# EAGLE design OPEN DROP DIGISCOPE (EAGLE 7.2.0)
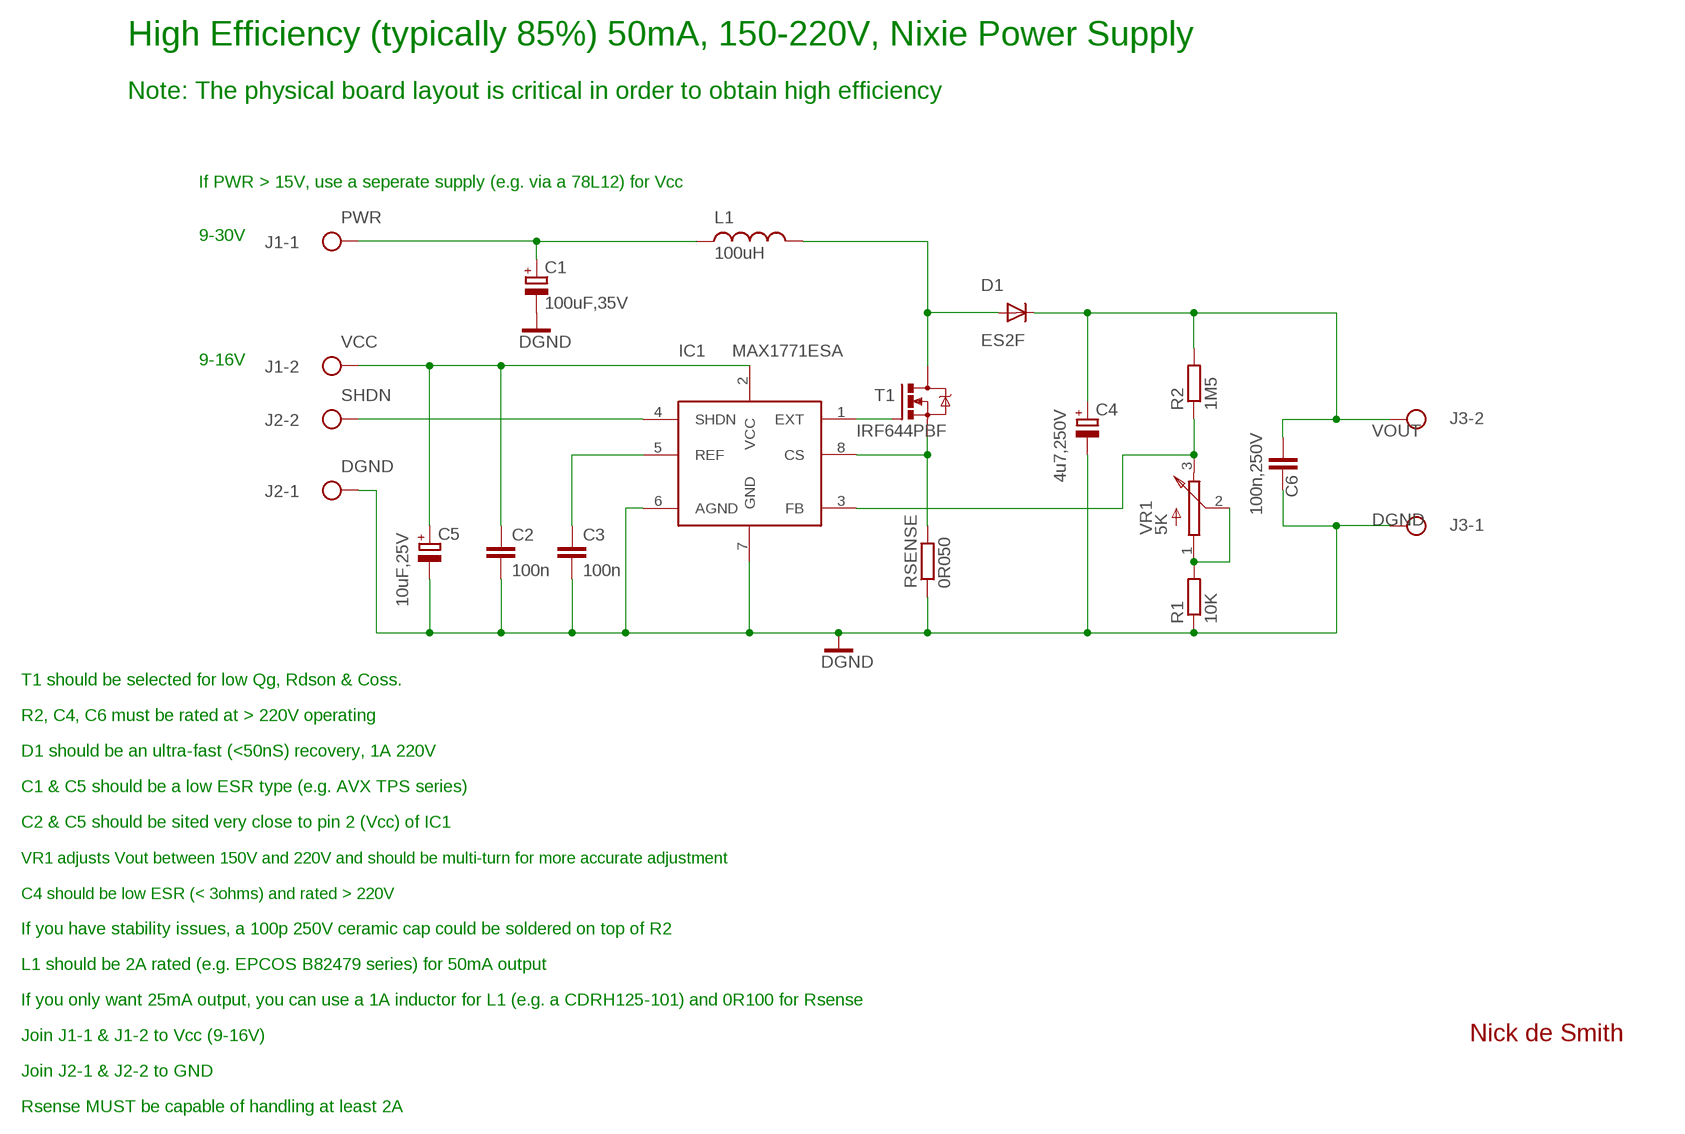
[diagram p0: schematic, sheet 1]

## Parts
C1  100uF,35V  C-POL-EU7343  [C-EIA-7343]
C2  100n  C-EUC0805  [C0805]
C3  100n  C-EUC0805  [C0805]
C4  4u7,250V  C-POL-EU-NICHICON-UJ-12  [NICHICON-UJ-12]
C5  10uF,25V  C-POL-EU7343  [C-EIA-7343]
C6  100n,250V  C-EU-2420  [C2420]
D1  ES2F  DIODE-SMC  [SMC]
IC1  MAX1771ESA  [SO-8]
J1  TERM-BLOCK-2-02IN  [SCREW-2-02]
J2  TERM-BLOCK-2-02IN  [SCREW-2-02]
J3  TERM-BLOCK-2-02IN  [SCREW-2-02]
L1  100uH  L-SMT-POWER-B82479  [L-B82479]
R1  10K  R-EU_R0805  [R0805]
R2  1M5  R-EU_R2512  [R2512]
RSENSE  0R050  R-EU_R2010  [R2010]
T1  IRF644PBF  IRF740  [TO220BV]
VR1  5K  TRIMPOT-3214W  [BOURNS-3214W]

## Nets
DGND [power]: C1.- C2.2 C3.2 C4.1(-) C5.- C6.P$2 IC1.6(AGND) IC1.7(GND) J2.1 J3.1 R1.1 RSENSE.1
EXT: IC1.1(EXT) T1.G
N$2: IC1.8(CS) RSENSE.2 T1.S
N$3: R1.2 VR1.1(A) VR1.2(W)
N$8: IC1.3(FB) R2.1 VR1.3(B)
N$15 [power]: D1.A L1.P$2 T1.D
N$17: C3.1 IC1.5(REF)
PWR [power]: C1.+ J1.1 L1.P$1
SHDN: IC1.4(SHDN) J2.2
VCC [power]: C2.1 C5.+ IC1.2(VCC) J1.2
VOUT [power]: C4.2(+) C6.P$1 D1.C J3.2 R2.2

## Notes on the sheet
- High Efficiency (typically 85%) 50mA, 150-220V, Nixie Power Supply
- Note: The physical board layout is critical in order to obtain high efficiency
- If PWR > 15V, use a seperate supply (e.g. via a 78L12) for Vcc
- 9-30V
- 9-16V
- T1 should be selected for low Qg, Rdson & Coss.
- R2, C4, C6 must be rated at > 220V operating
- D1 should be an ultra-fast (<50nS) recovery, 1A 220V
- C1 & C5 should be a low ESR type (e.g. AVX TPS series)
- C2 & C5 should be sited very close to pin 2 (Vcc) of IC1
- VR1 adjusts Vout between 150V and 220V and should be multi-turn for more accurate adjustment
- C4 should be low ESR (< 3ohms) and rated > 220V
- If you have stability issues, a 100p 250V ceramic cap could be soldered on top of R2
- L1 should be 2A rated (e.g. EPCOS B82479 series) for 50mA output
- If you only want 25mA output, you can use a 1A inductor for L1 (e.g. a CDRH125-101) and 0R100 for Rsense
- Join J1-1 & J1-2 to Vcc (9-16V) | Nick de Smith
- Join J2-1 & J2-2 to GND
- Rsense MUST be capable of handling at least 2A

## Library data of the parts
C1 C5 = nick:C-POL-EU7343: Capacitor, Tantalum, EU 7343 case, polarised
C2 C3 = rcl:C-EU: CAPACITOR, European symbol
C4 = nick:C-POL-EU: Capacitor, Tantalum, EU 7343 case, polarised
C6 = nick:C-EU
D1 = diode:DIODE-: DIODE
IC1 = nick:MAX1771
J1-J3 = nick:TERM-BLOCK-2
L1 = nick:L-SMT-POWER: SMT power inductors
R1 R2 RSENSE = rcl:R-EU_: RESISTOR, European symbol
T1 = transistor-power:IRF740: N-CHANNEL MOS FET
VR1 = nick:TRIMPOT

## Net classes
1 power: width 0.762 mm, clearance 0.508 mm

## Board
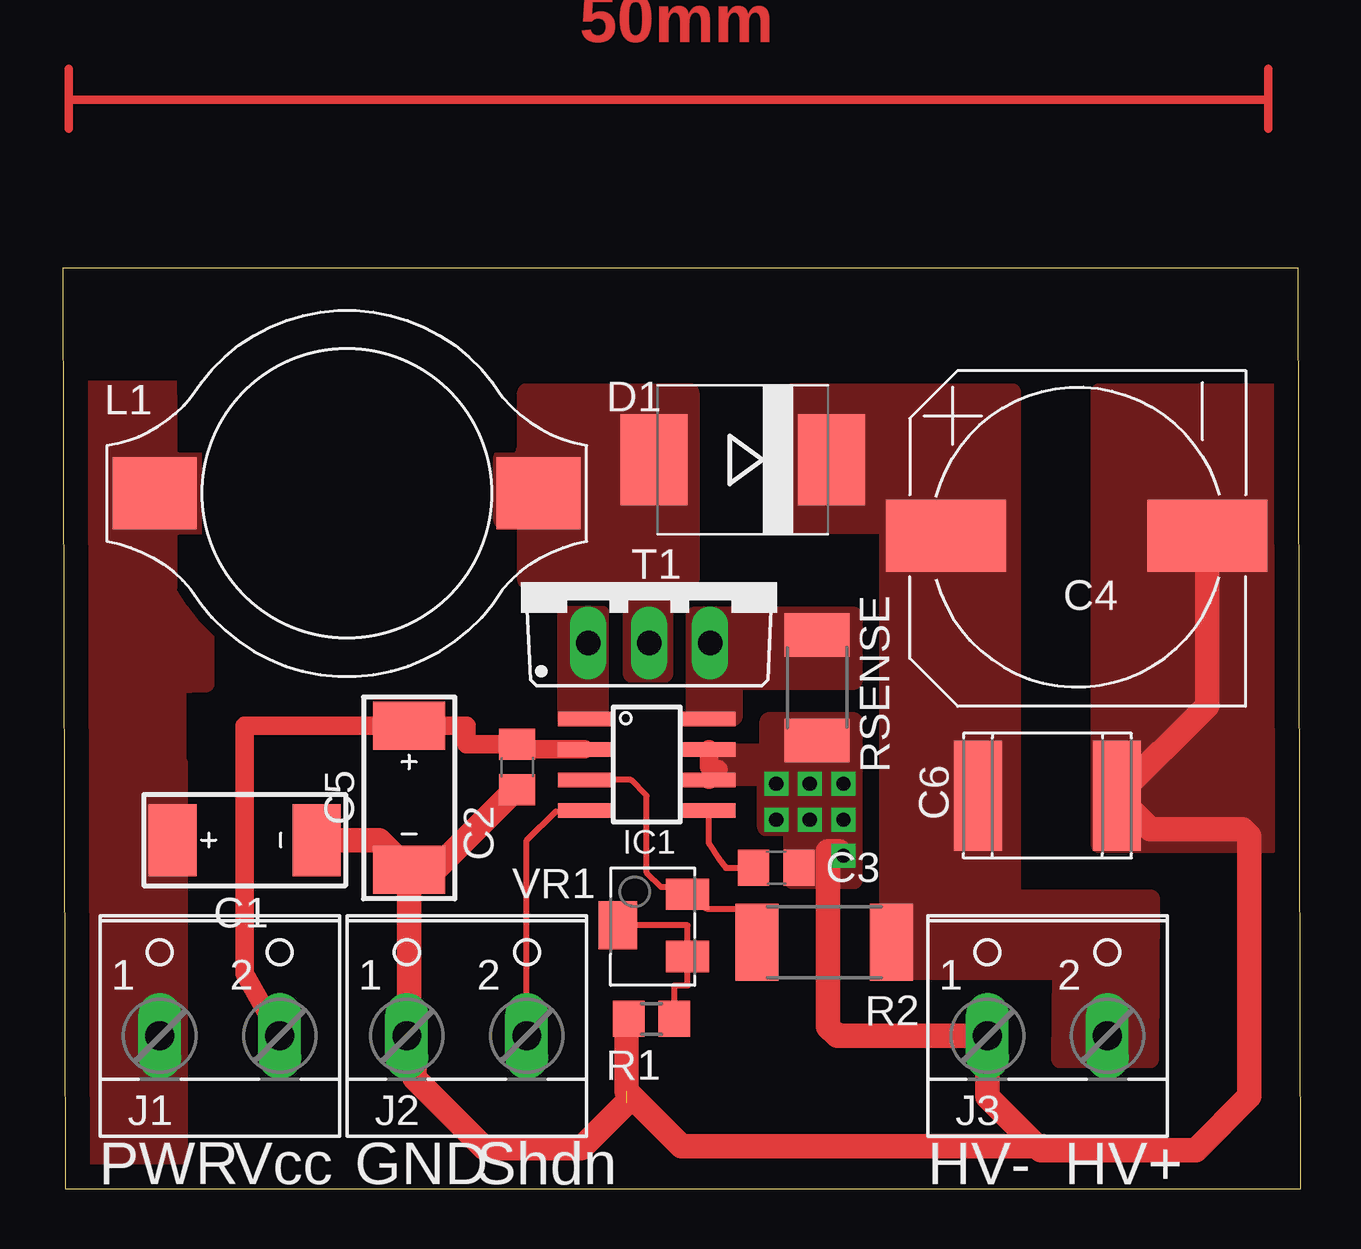
[diagram p1: board, top side]

Size 51.61 x 38.35 mm. Coordinates in mm from the lower left corner, seen from the top.
Outline: 0.11,0 51.61,0 51.5,38.35 0,38.35 0.11,0
Copper layers (1*16): Top 0.035mm / dielectric 1.5mm / Bottom 0.035mm
Design rules "Olimex 10mils *": minimum track width 10mil, minimum drill 0.6mm, track to track 10mil, track to pad 10mil, pad to pad 10mil, via to via 10mil, smd to smd 10mil, copper to edge 40mil, drill to drill 10mil, minimum pad ring 10mil, minimum via ring 8mil, stop-mask expansion 0mil, vias tented up to drill 0mil, thermal gap 10mil

### Footprints (pad centres in the part's own frame; a part is rotated, then mirrored left to right if it is on the bottom)
C-EIA-7343 = smd 2 x 3: + -3,0; - 3,0
C0805 = smd 1.3 x 1.5: 1 -0.95,0; 2 0.95,0
NICHICON-UJ-12 = smd 3 x 5: 1 -2.4,-7.6; 2 -2.4,3.3
C2420 = smd 2 x 4.6: P$1 2.9,0; P$2 -2.9,0
SMC = smd 2.8 x 3.8: A 3.7,0; C -3.7,0
SO-8 = smd 0.6 x 2.2: 1 -1.905,-2.6; 2 -0.635,-2.6; 3 0.635,-2.6; 4 1.905,-2.6; 5 1.905,2.6; 6 0.635,2.6; 7 -0.635,2.6; 8 -1.905,2.6
SCREW-2-02 = drill 1.194 long: 1 -2.5,0; 2 2.5,0
L-B82479 = smd 3.5 x 3: P$1 -8,0; P$2 8,0
R0805 = smd 1.3 x 1.5: 1 -0.95,0; 2 0.95,0
R2512 = smd 1.8 x 3.2: 1 -2.8,0; 2 2.8,0
R2010 = smd 1.8 x 2.7: 1 -2.2,0; 2 2.2,0
TO220BV = drill 1.016 long: D 0,-2.54; G -2.54,-2.54; S 2.54,-2.54
BOURNS-3214W = smd 1.8 x 1.3: 1 1.4,-1.3; 3 1.4,1.3 | smd 1.6 x 2: 2 -1.5,0

### Placement (x,y rotation side)
C1  7.58,14.53 0 top
C2  18.94,17.57 270 top
C3  29.74,13.37 0 top
C4  40.1,29.6 90 top
C5  14.43,16.28 270 top
C6  41.04,16.37 180 top
D1  28.34,30.37 180 top
IC1  24.34,17.67 270 top
J1  6.54,6.37 0 top
J2  16.84,6.37 0 top
J3  41.04,6.37 0 top
L1  11.84,28.97 0 top
R1  24.54,7.07 0 top
R2  31.74,10.27 0 top
RSENSE  31.44,20.87 90 top
T1  24.44,25.27 0 top
VR1  24.64,10.97 0 top

### Tracks (layer width: path | path; a pad name or v marks a point on that pad's centre or on a via)
DGND  (via drill 0.6)  (1 unrouted)
  Top 0.406: C2.2 15.6,13.28 C5.- 14.34,13.19 J2.1
  Top 0.762: IC1.6 27.04,17.07 27.34,17.17 | 27.34,17.47 27.04,17.47 26.94,17.57 IC1.7
  Top 1.016: C2.2 18.85,16.62 15.03,12.81 14.59,12.81 14.26,13.13 14.26,13.22 14.56,13.52 | 23.5,3.59 21.6,1.69 17.59,1.69 14.67,4.61 14.67,6.68 14.43,6.92 C5.- 13.18,14.53 C1.- | R1.1 23.5,6.98 23.5,4.05 25.79,1.76 40.86,1.76 41.02,1.6 | 41.02,1.6 40.77,1.6 38.54,3.83 J3.1 32.28,6.37 31.9,6.75 31.9,14.06 32.35,14.06 v32.54,13.87 | 41.02,1.6 47.21,1.6 49.45,3.84 49.45,14.68 49.15,14.98 45.33,14.98 C6.P$2 47.7,20.13 C4.1
  other vias: 29.74,16.87 31.14,15.37 32.54,15.37 32.54,16.87 31.14,16.87 29.74,15.37
  pour Top (no thermals): 27.34,17.17 27.34,18.17 29.44,18.17 29.44,19.47 32.94,19.47 32.94,12.87 30.44,12.87 30.44,15.07 29.34,15.07 29.34,17.17
  pour Top (rank 2, no thermals): 43.24,33.17 50.44,33.17 50.34,14.37 43.24,14.37
EXT
  pour Top (no thermals): 20.84,24.07 22.54,24.07 22.54,19.47 20.84,19.47
N$1
  Top 0.358: 0.24,45.37 0.24,46.67 | 0.24,45.37 0.24,44.17 | 0.24,45.37 50.24,45.37 | 50.24,45.37 50.24,46.67 | 50.24,45.37 50.24,44.17
N$2
  pour Top (no thermals): 26.36,19.67 26.36,23.87 32.94,23.87 32.94,21.17 27.94,21.17 27.94,19.67
N$3
  Top 0.254: VR1.2 26.04,10.97 VR1.1 26.04,8.47 25.49,8.47 R1.2
N$8
  Top 0.254: IC1.3 23.67,17.04 24.34,16.37 24.34,13.17 24.94,12.57 26.04,12.57 VR1.3 26.84,11.67 28.14,11.67 R2.1
N$15
  pour Top (rank 2, no thermals): 19.34,30.47 19.34,33.17 26.14,33.17 26.14,25.37 25.04,25.37 25.04,21.47 23.74,21.47 23.74,25.37 19.34,25.37 19.34,27.87 18.34,27.87 18.34,30.47
N$17
  Top 0.254: C3.1 27.64,13.37 27.34,13.77 26.94,14.37 IC1.5
PWR
  pour Top (isolate 0.01, rank 2, no thermals): 4.84,17.67 4.76,17.63 4.76,21.03 5.94,21.07 5.94,33.27 0.84,33.27 0.84,1.37 4.84,1.37
SHDN
  Top 0.254: J2.2 19.34,14.51 20.54,15.71 IC1.4
VCC
  Top 0.762: J1.2 7.58,8.96 7.57,19.3 C5.+ 16.84,19.28 16.84,18.52 C2.1 18.94,18.3 IC1.2
VOUT
  pour Top (isolate 0.01, rank 2, no thermals): 30.44,33.17 39.54,33.17 39.54,12.07 45.34,12.07 45.29,5.41 41.59,5.41 41.64,9.07 34.44,9.07 34.44,27.67 30.44,27.67
(copper drawn outside any net)
  shapes: Top area x1

### Text on the board
Top: 50mm
tPlace: PWR | Vcc | GND | Shdn | HV- | HV+
Measures: 0.000 | 0.146 | 1.839 | 1.655 | 1.512 | 1.508 | 0.154 | 0.000 | 0.000 | 0.001 | 0.000 | 0.001 | 0.000 | 0.000 | 1.209 | 2.026